# EAGLE design controllerver2 (EAGLE 6.6.0)
saraste valo controller ver 2 Muutoksia: vaihdettu 7hc165 oikeaan järjestykseen. listätty napppi encoderin liittimeen.
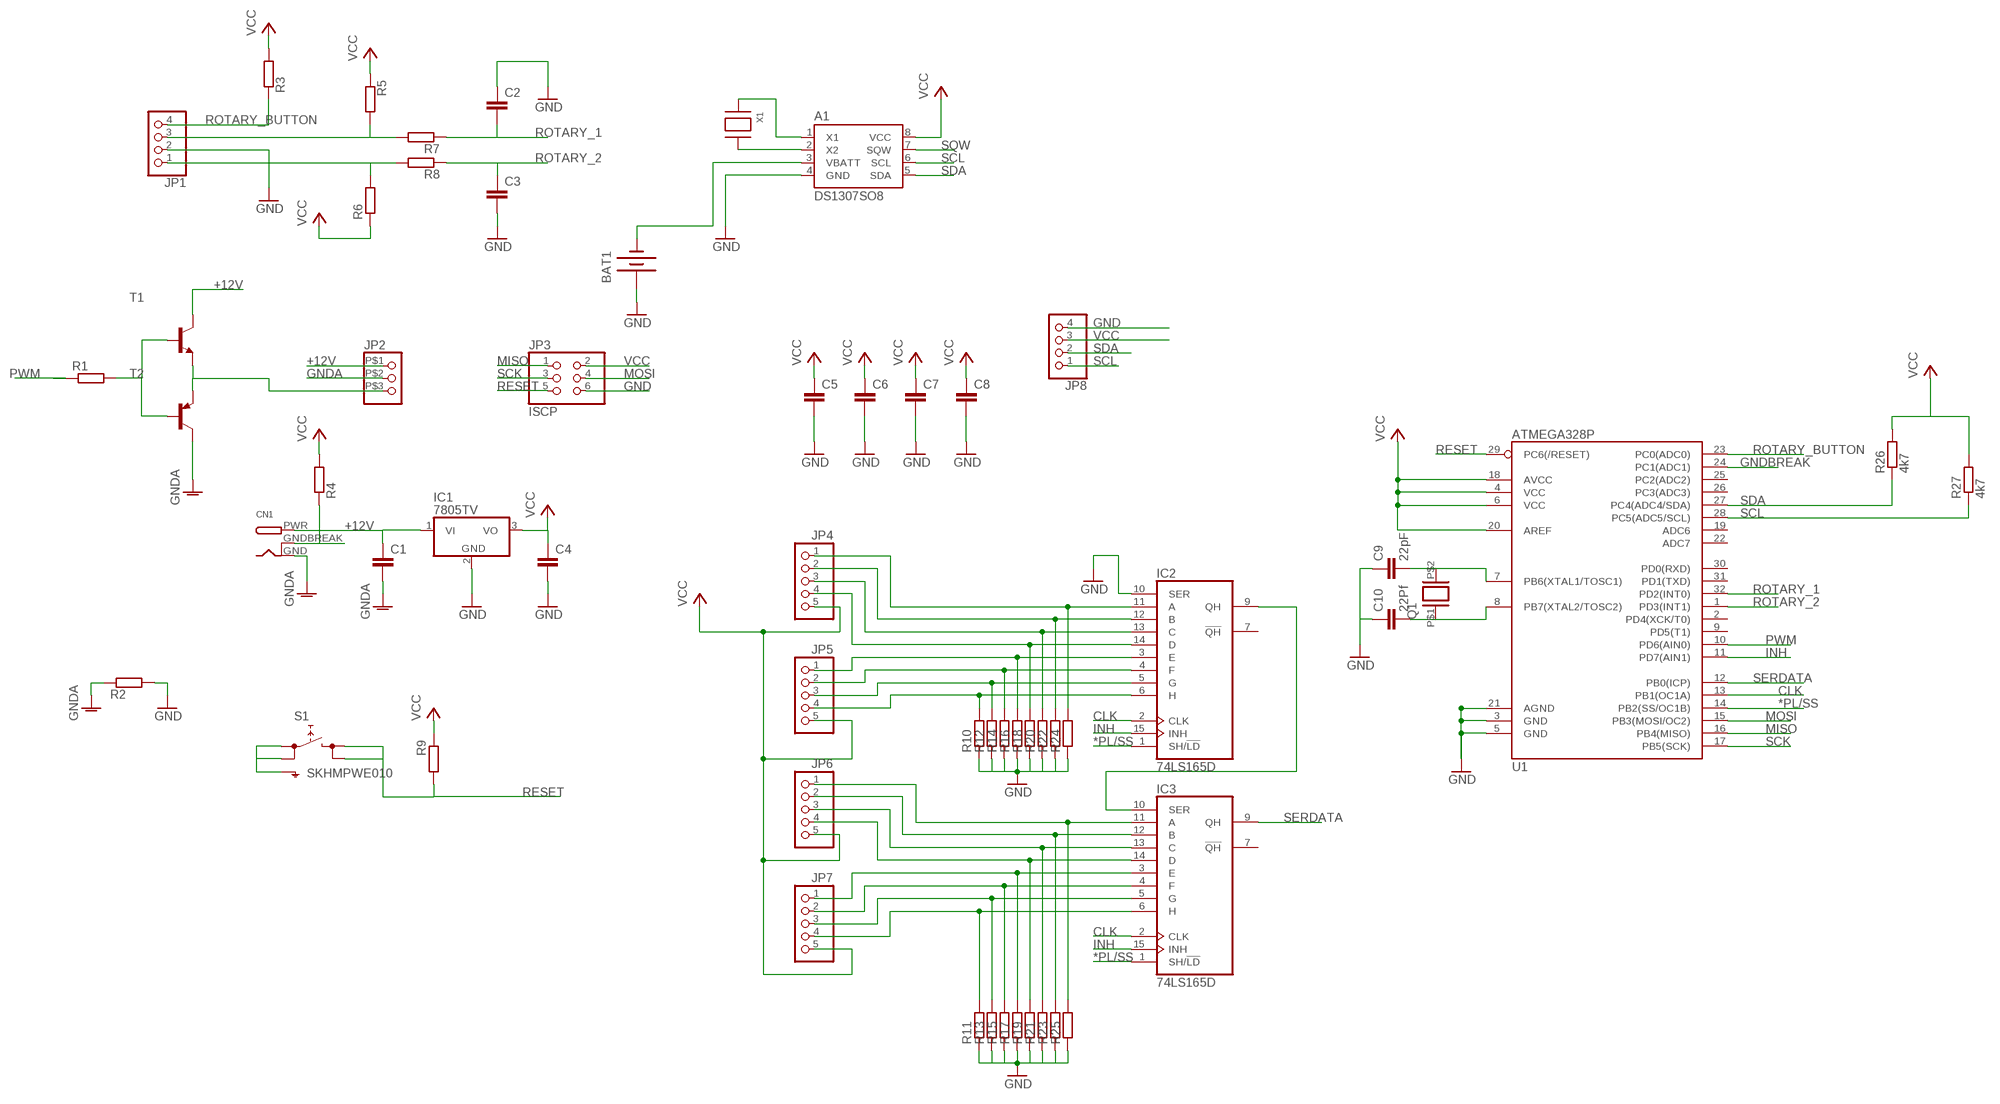
[diagram p0: schematic, sheet 1]

## Parts
A1  DS1307SO8  [SO08]
BAT1  BATTERY20SMD  [BATTCON_20MM]
C1  C-EUC0805  [C0805]
C2  C-EUC0805  [C0805]
C3  C-EUC0805  [C0805]
C4  C-EUC0805  [C0805]
C5  C-EUC0805  [C0805]
C6  C-EUC0805  [C0805]
C7  C-EUC0805  [C0805]
C8  C-EUC0805  [C0805]
C9  22pF  C-EUC0805  [C0805]
C10  22Pf  C-EUC0805  [C0805]
CN1  DCBARRELPTH  [DCJACK_2MM_PTH]
IC1  7805TV  [TO220V]
IC2  74LS165D  [SO16]
IC3  74LS165D  [SO16]
JP1  PINHD-1X4  [1X04]
JP2  PINHD-1X35.08  [1X03/5.08]
JP3  ISCP  PINHD-2X3  [2X03]
JP4  PINHD-1X5  [1X05]
JP5  PINHD-1X5  [1X05]
JP6  PINHD-1X5  [1X05]
JP7  PINHD-1X5  [1X05]
JP8  PINHD-1X4  [1X04]
Q1  XTAL  [CSM-3X]
R1  R-EU_R0805  [R0805]
R2  R-EU_R0805  [R0805]
R3  R-EU_R0805  [R0805]
R4  R-EU_R0805  [R0805]
R5  R-EU_R0805  [R0805]
R6  R-EU_R0805  [R0805]
R7  R-EU_R0805  [R0805]
R8  R-EU_R0805  [R0805]
R9  R-EU_R0805  [R0805]
R10  R-EU_R0805  [R0805]
R11  R-EU_R0805  [R0805]
R12  R-EU_R0805  [R0805]
R13  R-EU_R0805  [R0805]
R14  R-EU_R0805  [R0805]
R15  R-EU_R0805  [R0805]
R16  R-EU_R0805  [R0805]
R17  R-EU_R0805  [R0805]
R18  R-EU_R0805  [R0805]
R19  R-EU_R0805  [R0805]
R20  R-EU_R0805  [R0805]
R21  R-EU_R0805  [R0805]
R22  R-EU_R0805  [R0805]
R23  R-EU_R0805  [R0805]
R24  R-EU_R0805  [R0805]
R25  R-EU_R0805  [R0805]
R26  4k7  R-EU_R0805  [R0805]
R27  4k7  R-EU_R0805  [R0805]
S1  SKHMPWE010  [SKHMPXE010]
T1  BC847-NPN-SOT23-BEC  [SOT23-BEC]
T2  BC807-16-PNP-SOT23-BEC  [SOT23-BEC]
U1  ATMEGA328P  ATMEGA328_SMT  [TQFP32-08]
X1  XTAL-3.2X1.5  [XTAL3215]

## Nets
*PL/SS: IC2.1(SH/!LD) IC3.1(SH/!LD) U1.14(PB2(SS/OC1B))
+12V [high power]: C1.1 CN1.PWR IC1.1(VI) JP2.P$1 T1.C
CLK: IC2.2(CLK) IC3.2(CLK) U1.13(PB1(OC1A))
GND [gnd]: A1.4(GND) BAT1.1(+) C2.1 C3.2 C4.2 C5.2 C6.2 C7.2 C8.2 C9.1 C10.1 IC1.2(GND) IC2.10(SER) JP1.2 JP3.6 JP8.4 R2.2 R10.1 R11.1 R12.1 R13.1 R14.1 R15.1 R16.1 R17.1 R18.1 R19.1 R20.1 R21.1 R22.1 R23.1 R24.1 R25.1 S1.1(1.1) S1.2(1.2) S1.5(SH) U1.3(GND) U1.5(GND) U1.21(AGND)
GNDA [high power gnd]: C1.2 CN1.GND JP2.P$2 R2.1 T2.C
GNDBREAK: CN1.GNDBREAK R4.1 U1.24(PC1(ADC1))
INH: IC2.15(INH) IC3.15(INH) U1.11(PD7(AIN1))
MISO: JP3.1 U1.16(PB4(MISO))
MOSI: JP3.4 U1.15(PB3(MOSI/OC2))
N$1: IC2.11(A) JP4.1 R24.2
N$2: IC2.12(B) JP4.2 R22.2
N$3: IC2.13(C) JP4.3 R20.2
N$4: IC2.14(D) JP4.4 R18.2
N$5: IC2.3(E) JP5.1 R16.2
N$6: IC2.4(F) JP5.2 R14.2
N$7: IC2.5(G) JP5.3 R12.2
N$8: IC2.6(H) JP5.4 R10.2
N$9: IC3.11(A) JP6.1 R25.2
N$10: IC3.12(B) JP6.2 R23.2
N$11: IC3.13(C) JP6.3 R21.2
N$12: IC3.14(D) JP6.4 R19.2
N$13: IC3.3(E) JP7.1 R17.2
N$14: IC3.4(F) JP7.2 R15.2
N$15: IC3.5(G) JP7.3 R13.2
N$16: IC3.6(H) JP7.4 R11.2
N$17: JP1.3 R5.2 R7.2
N$18 [high power]: JP2.P$3 T1.E T2.E
N$19: JP1.1 R6.2 R8.2
N$20: IC2.9(QH) IC3.10(SER)
N$21: A1.3(VBATT) BAT1.2(-)
N$22: C9.2 Q1.P$2 U1.7(PB6(XTAL1/TOSC1))
N$23: C10.2 Q1.P$1 U1.8(PB7(XTAL2/TOSC2))
N$25: R1.2 T1.B T2.B
N$28: A1.2(X2) X1.P$2
N$29: A1.1(X1) X1.P$1
PWM: R1.1 U1.10(PD6(AIN0))
RESET: JP3.5 R9.2 S1.3(2.1) S1.4(2.2) U1.29(PC6(/RESET))
ROTARY_1: C2.2 R7.1 U1.32(PD2(INT0))
ROTARY_2: C3.1 R8.1 U1.1(PD3(INT1))
ROTARY_BUTTON: JP1.4 R3.1 U1.23(PC0(ADC0))
SCK: JP3.3 U1.17(PB5(SCK))
SCL: A1.6(SCL) JP8.1 R27.1 U1.28(PC5(ADC5/SCL))
SDA: A1.5(SDA) JP8.2 R26.1 U1.27(PC4(ADC4/SDA))
SERDATA: IC3.9(QH) U1.12(PB0(ICP))
SQW: A1.7(SQW)
VCC [vcc]: A1.8(VCC) C4.1 C5.1 C6.1 C7.1 C8.1 IC1.3(VO) JP3.2 JP4.5 JP5.5 JP6.5 JP7.5 JP8.3 R3.2 R4.2 R5.1 R6.1 R9.1 R26.2 R27.2 U1.4(VCC) U1.6(VCC) U1.18(AVCC) U1.20(AREF)
Unconnected: IC2.7(!QH) IC3.7(!QH) U1.2(PD4(XCK/T0)) U1.9(PD5(T1)) U1.19(ADC6) U1.22(ADC7) U1.25(PC2(ADC2)) U1.26(PC3(ADC3)) U1.30(PD0(RXD)) U1.31(PD1(TXD))

## Power pins joined to a net without a drawn wire
GND: IC2.8(GND) IC3.8(GND)
VCC: IC2.16(VCC) IC3.16(VCC)

## Library data of the parts
A1 = SparkFun-FreqCtrl:DS1307: I2C real-time clock with battery backup.
BAT1 = SparkFun-Electromechanical:BATTERY: Battery Holders Various common sizes : AA, AAA, 18650 (PRT-12895), 20mm coin cell and 12mm coin cell. 20MM_4LEGS, BATT-10373
C1-C10 = rcl:C-EU: CAPACITOR, European symbol
CN1 = adafruit:DCBARREL: 2.0mm DC Barrel Jack DCJACK_2MM_PTH - Through Hole Jack (4UConnector: 05537)
IC1 = linear:78*: Positive VOLTAGE REGULATOR Source: http://cache.national.com/ds/LM/LM78L05.pdf http://www.fairchildsemi.com/ds/LM/LM7805.pdf
IC2 IC3 = 74xx-us:74*165: 8-bit parallel load SHIFT REGISTER
JP1 JP8 = pinhead:PINHD-1X4: PIN HEADER
JP2 = 1omat:PINHD-1X3: PIN HEADER
JP3 = pinhead:PINHD-2X3: PIN HEADER
JP4-JP7 = pinhead:PINHD-1X5: PIN HEADER
Q1 = 1omat:XTAL: CRYSTAL
R1-R27 = resistor:R-EU_: RESISTOR, European symbol
S1 = switch:SKHMP*E010: 6.2 X 6.5mm TACT Switch (SMD) Source: http://www3.alps.co.jp/WebObjects/catalog.woa/PDF/E/Switch/Tact/SKHM/SKHM.PDF
T1 = transistor:*-NPN-: NPN Transistror BF959 corrected 2008.03.06
T2 = transistor:*-PNP-: PNP Transistror
U1 = SparkFun-DigitalIC:ATMEGA328_SMT: 32-Pin Atmega328 part Commonly used on Arduino compatible boards Available in QFP and QFN packages TQFP is IC-09069 QFN is non-stock; PROD_ID: IC-09069
X1 = adafruit:XTAL: Low cost SMT crystals, no capacitors included http://www.ladyada.net/library/eagle

## Net classes
0 default: width 0.254 mm, drill 0.33 mm
1 vcc: width 0.508 mm, drill 0.33 mm
2 gnd: width 0.508 mm, drill 0.33 mm
3 high power: width 1.016 mm, drill 0.508 mm
4 high power gnd: width 1.016 mm, drill 0.508 mm

## Board
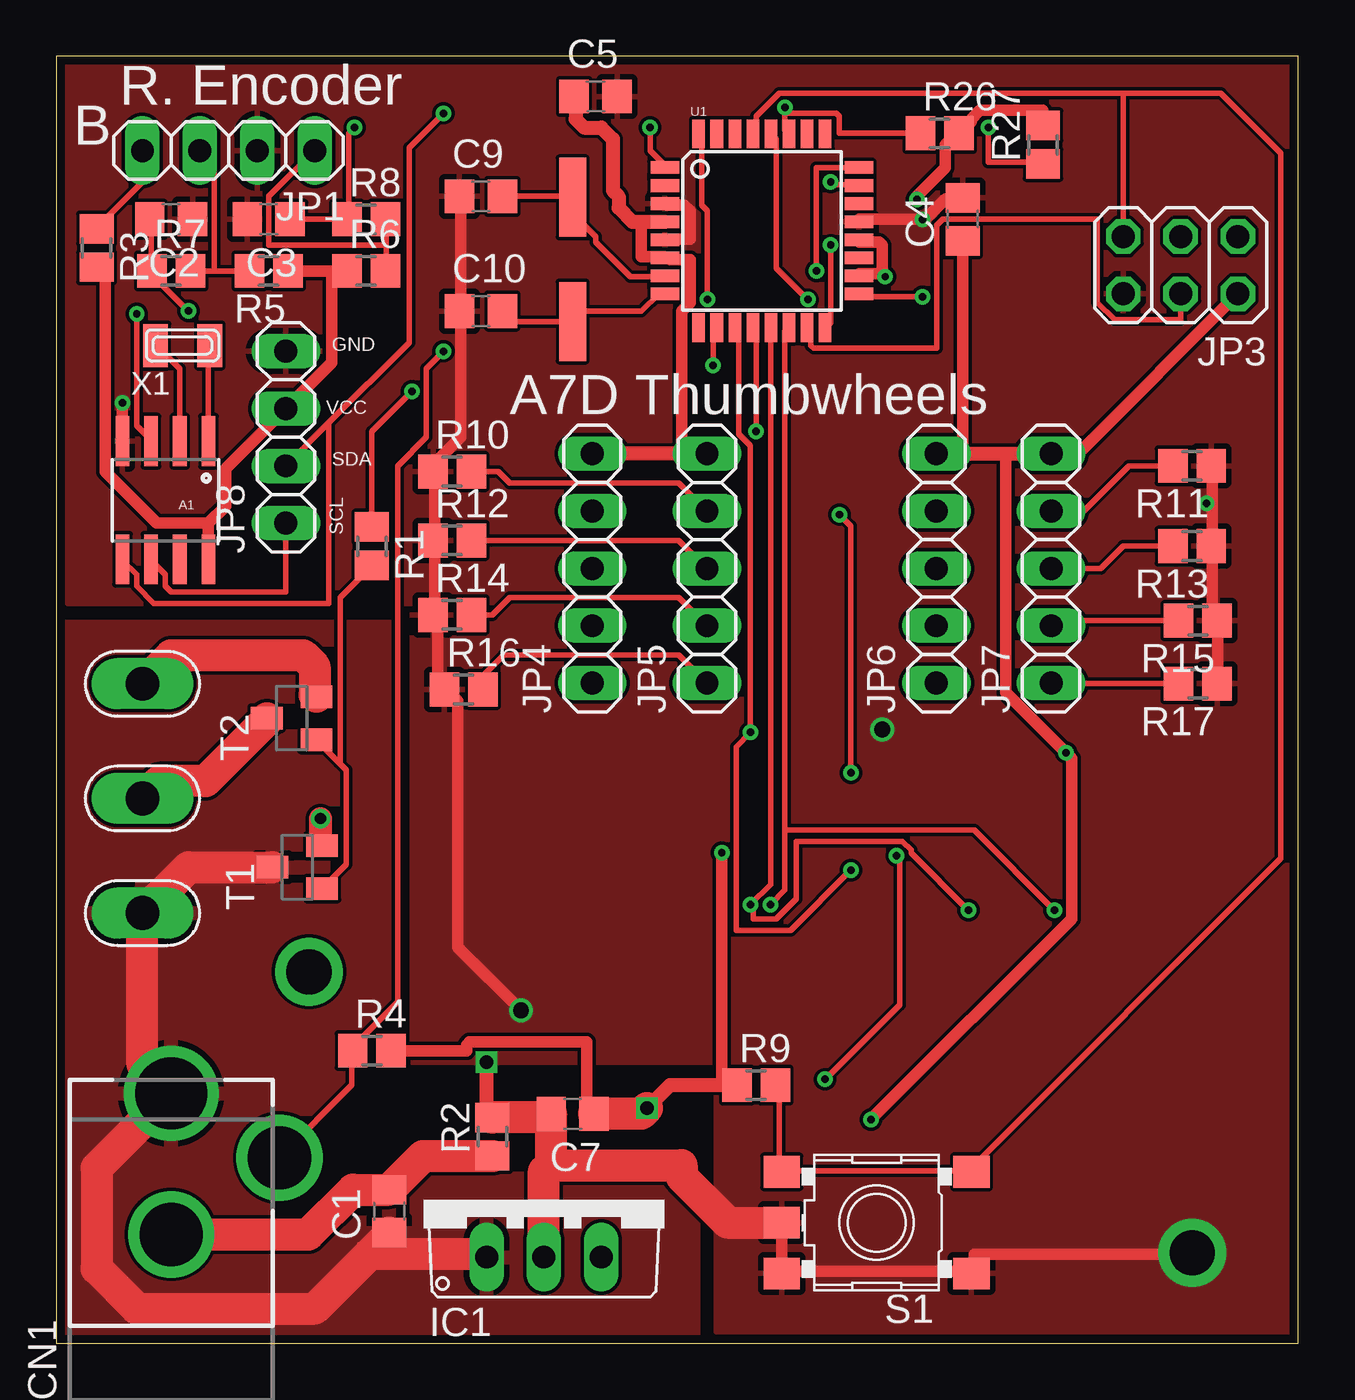
[diagram p1: board, top side]
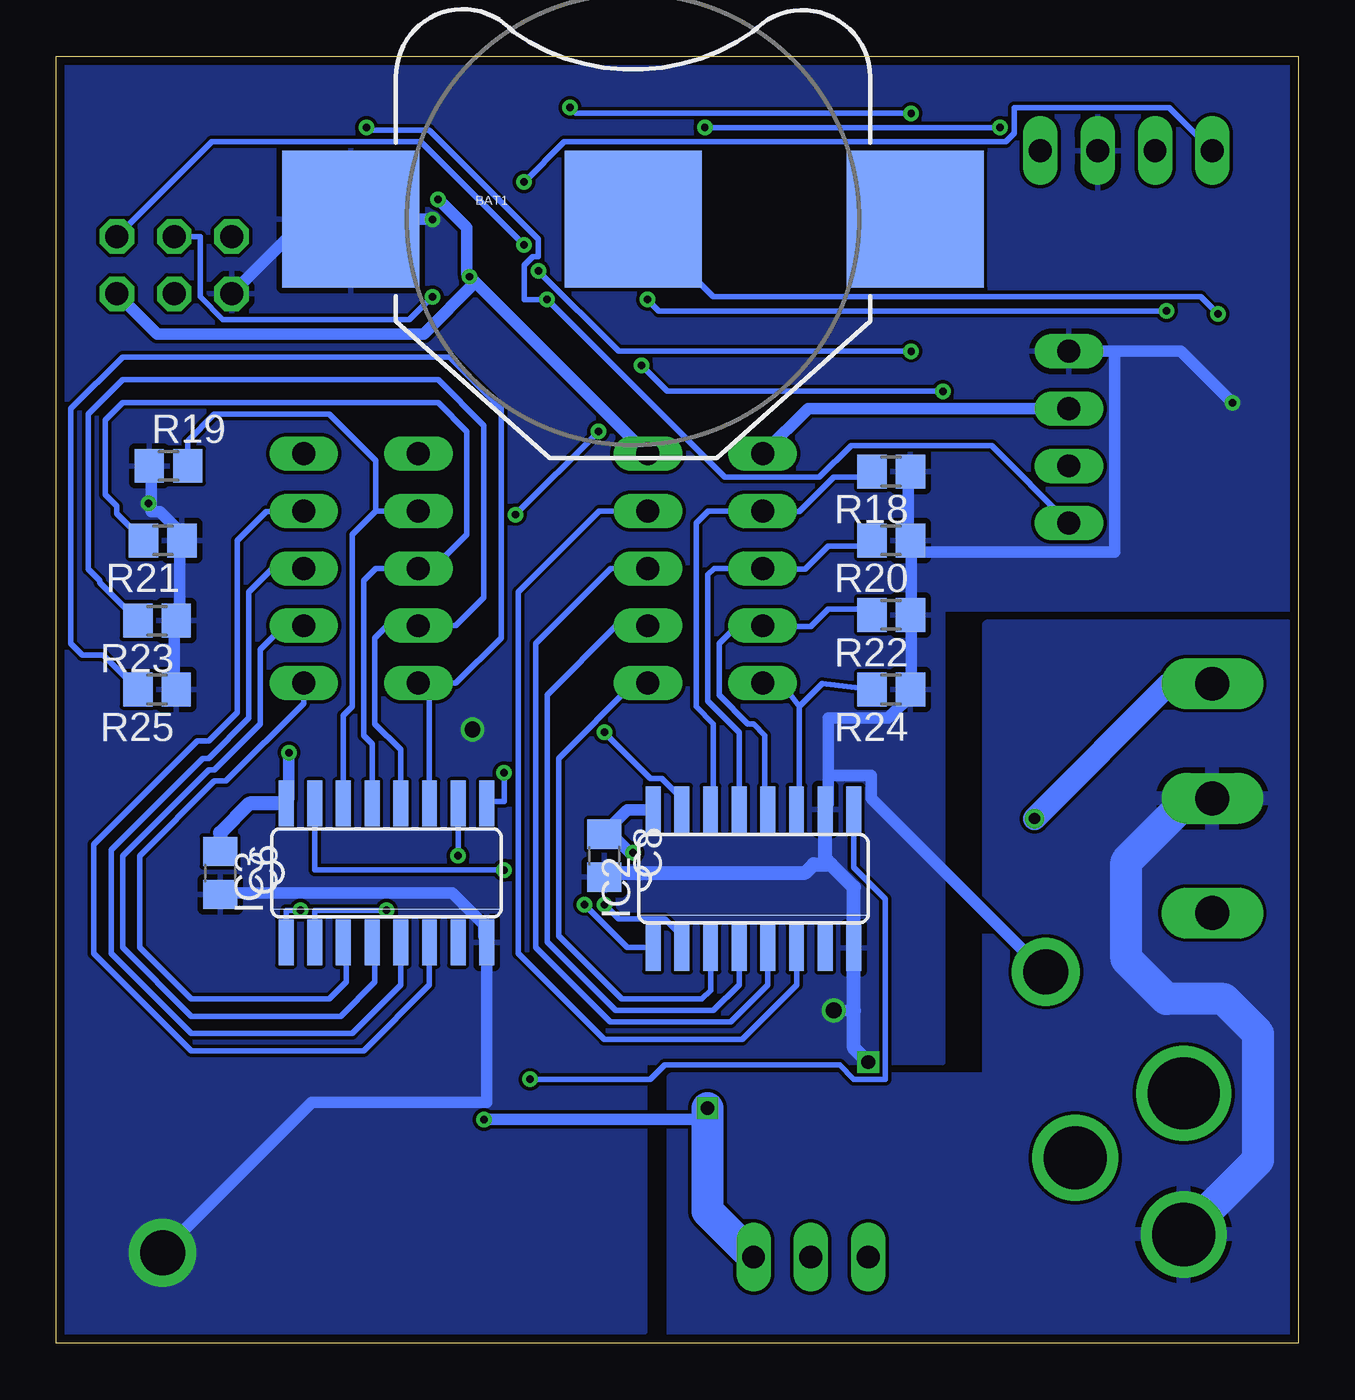
[diagram p2: board, bottom side, seen from below]

Size 55 x 57 mm. Coordinates in mm from the lower left corner, seen from the top.
Outline: 0,0 55,0 55,57 0,57 0,0
Copper layers (1*16): Top 0.0356mm / dielectric 1.5011mm / Bottom 0.0356mm
Design rules "LaenPCBOrder": minimum track width 6mil, minimum drill 13mil, track to track 6mil, track to pad 6mil, pad to pad 6mil, via to via 6mil, smd to smd 6mil, copper to edge 15mil, drill to drill 6mil, minimum pad ring 7mil, minimum via ring 7mil, stop-mask expansion 3mil, vias tented up to drill 0mil, thermal gap 10mil

### Footprints (pad centres in the part's own frame; a part is rotated, then mirrored left to right if it is on the bottom)
SO08 = smd 0.61 x 2.21: 1 -1.905,-2.616; 2 -0.635,-2.616; 3 0.635,-2.616; 4 1.905,-2.616; 5 1.905,2.616; 6 0.635,2.616; 7 -0.635,2.616; 8 -1.905,2.616
BATTCON_20MM = smd 6.07 x 6.07: 1 -12.5,0; 2 0,0; 3 12.5,0
C0805 = smd 1.3 x 1.5: 1 -0.95,0; 2 0.95,0
DCJACK_2MM_PTH = drill 2.8: GND 0,7.35; GNDBREAK 4.8,10.75 | drill 3.2: PWR 0,13.6
TO220V = drill 1.016 long: 1 -2.54,-2.54; 2 0,-2.54; 3 2.54,-2.54
SO16 = smd 0.66 x 2.032: 1 -4.445,-3.073; 2 -3.175,-3.073; 3 -1.905,-3.073; 4 -0.635,-3.073; 5 0.635,-3.073; 6 1.905,-3.073; 7 3.175,-3.073; 8 4.445,-3.073; 9 4.445,3.073; 10 3.175,3.073; 11 1.905,3.073; 12 0.635,3.073; 13 -0.635,3.073; 14 -1.905,3.073; 15 -3.175,3.073; 16 -4.445,3.073
1X04 = drill 1.016 long: 1 -3.81,0; 2 -1.27,0; 3 1.27,0; 4 3.81,0
1X03/5.08 = drill 1.5 long: P$1 -5.08,0; P$2 0,0; P$3 5.08,0
2X03 = drill 1.016 octagon: 1 -2.54,-1.27; 2 -2.54,1.27; 3 0,-1.27; 4 0,1.27; 5 2.54,-1.27; 6 2.54,1.27
1X05 = drill 1.016 long: 1 -5.08,0; 2 -2.54,0; 3 0,0; 4 2.54,0; 5 5.08,0
CSM-3X = smd 3.5 x 1.2: P$1 -2.75,0; P$2 2.75,0
R0805 = smd 1.3 x 1.5: 1 -0.85,0; 2 0.85,0
SKHMPXE010 = smd 1.6 x 1.4: 1 -4.2,2.25; 2 4.2,2.25; 3 -4.2,-2.25; 4 4.2,-2.25; 5 4.2,0
SOT23-BEC = smd 1 x 1.4: B -0.95,-1.1; C 0,1.1; E 0.95,-1.1
TQFP32-08 = smd 1.27 x 0.559: 1 -4.293,2.8; 2 -4.293,2; 3 -4.293,1.2; 4 -4.293,0.4; 5 -4.293,-0.4; 6 -4.293,-1.2; 7 -4.293,-2; 8 -4.293,-2.8; 17 4.293,-2.8; 18 4.293,-2; 19 4.293,-1.2; 20 4.293,-0.4; 21 4.293,0.4; 22 4.293,1.2; 23 4.293,2; 24 4.293,2.8 | smd 0.559 x 1.27: 9 -2.8,-4.293; 10 -2,-4.293; 11 -1.2,-4.293; 12 -0.4,-4.293; 13 0.4,-4.293; 14 1.2,-4.293; 15 2,-4.293; 16 2.8,-4.293; 25 2.8,4.293; 26 2,4.293; 27 1.2,4.293; 28 0.4,4.293; 29 -0.4,4.293; 30 -1.2,4.293; 31 -2,4.293; 32 -2.8,4.293
XTAL3215 = smd 1.1 x 1.9: P$1 1.2,0; P$2 -1.2,0

### Placement (x,y rotation side)
A1  4.83,37.34 180 top
BAT1  29.46,49.78 0 bottom
C1  14.73,5.84 90 top
C2  5.08,49.78 180 top
C3  9.4,49.78 180 top
C4  40.13,49.78 90 top
C5  23.88,55.23 0 top
C6  47.75,20.83 270 bottom
C7  22.86,10.16 180 top
C8  30.73,21.59 270 bottom
C9  18.8,50.8 0 top
C10  18.8,45.72 0 top
CN1  5.08,-2.54 0 top
IC1  21.59,6.35 0 top
IC2  24.13,20.57 0 bottom
IC3  40.39,20.83 0 bottom
JP1  7.62,52.83 180 top
JP2  3.81,24.13 90 top
JP3  49.78,47.75 180 top
JP4  23.73,34.32 90 top
JP5  28.81,34.32 90 top
JP6  38.97,34.32 90 top
JP7  44.05,34.32 90 top
JP8  10.16,40.13 90 top
Q1  22.86,48.01 90 top
R1  13.97,35.31 270 top
R2  19.3,9.14 90 top
R3  1.78,48.51 270 top
R4  13.97,12.95 0 top
R5  9.4,47.5 180 top
R6  13.72,47.5 0 top
R7  5.08,47.5 0 top
R8  13.72,49.78 0 top
R9  30.99,11.43 0 top
R10  17.53,38.61 0 top
R11  50.29,38.86 180 top
R12  17.53,35.56 0 top
R13  50.29,35.31 180 top
R14  17.53,32.26 0 top
R15  50.55,32 180 top
R16  18.03,28.96 0 top
R17  50.55,29.21 180 top
R18  18.03,38.61 180 bottom
R19  50.04,38.86 0 bottom
R20  18.03,35.56 180 bottom
R21  50.29,35.56 180 bottom
R22  18.03,32.26 180 bottom
R23  50.55,32 180 bottom
R24  18.03,28.96 180 bottom
R25  50.55,28.96 180 bottom
R26  39.12,53.59 0 top
R27  43.69,53.09 90 top
S1  36.32,5.33 180 top
T1  10.67,21.08 90 top
T2  10.41,27.69 90 top
U1  31.24,49.28 0 top
X1  5.59,44.2 0 top

### Tracks (layer width: path | path; a pad name or v marks a point on that pad's centre or on a via)
*PL/SS  (via drill 0.33)
  Top 0.254: 32.26,22.73 32.26,20.07 v31.62,19.43 | 32.26,22.73 32.26,44.83 32.38,44.96 U1.14 | v44.2,19.18 40.64,22.73 32.26,22.73
  Bottom 0.254: v31.62,19.43 29.72,17.53 28.57,17.53 IC2.1 | IC3.1 44.83,19.18 v44.2,19.18
+12V
  Top 1.422: T1.C 5.84,21.08 JP2.P$1 3.81,12.33 CN1.PWR 1.78,7.76 1.78,3.3 3.56,1.52 11.43,1.52 13.84,3.94 | 13.84,3.94 14.73,4.83 C1.1 | IC1.1 18.92,3.94 13.84,3.94
  pour Top: 0.51,31.75 14.73,31.75 14.73,11.43 28.19,11.43 28.19,0.25 0.51,0.25
CLK  (via drill 0.33)
  Top 0.254: U1.13 31.62,44.96 31.62,20.32 v30.73,19.43 30.86,19.43 30.86,18.8 31.88,18.8 32.77,19.68 32.77,22.23 37.47,22.23 37.85,21.84 37.85,21.72 v40.39,19.18
  Bottom 0.254: v30.73,19.43 30.1,18.8 28.07,18.8 27.3,18.03 IC2.2 | IC3.2 43.56,19.18 v40.39,19.18
GND  (via drill 0.33, 0.6, 0.7, 2)
  Top 0.508: R17.1 51.44,29.21 51.44,32 R15.1 51.18,32.13 51.18,35.31 R13.1 51.18,35.43 51.18,37.21 | 51.18,37.21 51.18,38.86 R11.1 | v50.93,37.21 51.18,37.21 | S1.5 32.13,4.7 32.13,3.17 S1.2 32.38,3.17 40.26,3.17 S1.1 40.64,3.3 40.64,3.94 50.29,3.94 v50.3,4 | U1.21 35.56,49.78 v38.35,49.78 38.48,49.78 39.37,50.67 40.13,50.67 C4.2 | C9.1 17.91,50.8 17.91,45.72 C10.1 17.91,45.59 17.91,40.13 16.89,39.12 16.89,38.73 R10.1 16.76,38.61 16.76,35.69 R12.1 16.76,35.56 16.76,32.26 R14.1 16.89,32.13 16.89,29.21 17.14,28.96 R16.1 17.4,28.83 17.78,28.45 17.78,17.53 v20.57,14.73 | U1.5 27.05,48.9 28.07,48.9 28.07,50.16 27.81,50.42 27.05,50.42 U1.3 | v2.92,41.66 A1.4
  Top 0.61: R2.2 19.05,10.25 v19.05,12.45
  Top 1.422: IC1.2 21.59,7.62 arc90 21.91,7.94 | 21.91,7.94 C7.2 arc-90 21.74,9.99 R2.2 | 21.91,7.94 arc90 21.98,7.87 27.69,7.87 27.69,7.37 29.72,5.33 S1.5
  Bottom 0.508: R25.1 49.78,28.96 49.78,32 R23.1 49.53,32.13 49.53,35.56 R21.1 49.28,35.69 50.42,36.83 50.8,36.83 50.8,37.21 | 50.8,37.21 50.8,38.86 R19.1 | v50.93,37.21 50.8,37.21 | 17.27,28.96 R16.1 | 17.27,32.26 R22.1 | C6.2 47.75,19.94 37.47,19.94 36.07,18.54 36.07,18.03 IC3.8 35.94,10.67 43.69,10.67 50.29,4.06 v50.3,4 | v38.35,49.78 BAT1.1 42.16,49.66 44.07,49.66 JP3.6 | v2.92,41.66 5.21,43.94 8.13,43.94 | JP8.4 8.13,43.94 | R20.1 17.27,35.56 17.27,38.61 R18.1 | 19.68,14.73 v20.57,14.73 | 20.83,25.15 20.83,27.69 18.16,27.69 17.02,28.83 R16.1 | 20.83,25.15 20.83,23.88 IC2.10 | R22.1 17.14,32.13 17.14,29.21 R16.1 | 20.83,25.15 18.92,25.15 18.92,24.13 11.3,16.51 v11.18,16.45 | R20.1 17.14,35.43 17.14,32.51 R22.1 | 8.13,43.94 8.13,35.05 17.02,35.05 R20.1
  Bottom 0.61: v19.05,12.45 19.68,13.08 19.68,14.73 IC2.8 19.68,20.19 20.7,21.21 | 20.7,21.21 20.95,21.46 IC2.10 | C8.2 30.55,20.83 21.84,20.83 21.46,21.21 20.7,21.21
  other vias: 36.58,27.18
  pour Top: 0.51,56.64 0.51,32.77 15.75,32.77 15.75,12.45 29.21,12.45 29.21,0.51 54.86,0.51 54.86,56.64
  pour Bottom: 0,56.9 0,32.51 15.75,32.51 15.75,12.45 28.96,12.45 28.96,0.51 54.86,0.51 54.86,56.9
GNDA
  Top 1.422: R2.1 16.23,8.29 C1.2 13.14,6.79 11.16,4.81 CN1.GND | T2.C 9.31,27.6 6.6,24.89 4.57,24.89 JP2.P$2
  Bottom 1.422: JP2.P$2 4.83,24.13 7.62,21.34 7.62,17.02 5.84,15.24 3.3,15.24 1.78,13.72 1.78,8.11 CN1.GND
  pour Bottom: 0.51,31.75 13.72,31.75 13.72,16 13.72,11.68 27.69,11.68 27.69,0.51 0.51,0.51
GNDBREAK  (via drill 0.33)
  Top 0.254: CN1.GNDBREAK 9.91,8.26 13.08,11.43 13.08,12.95 R4.1 13.21,12.95 13.21,13.21 15.11,15.11 15.11,38.86 16.38,40.13 16.38,43.18 v17.14,43.94 | v33.66,47.5 33.66,52.07 35.43,52.07 U1.24
  Bottom 0.254: v33.66,47.5 30.1,43.94 v17.14,43.94
INH  (via drill 0.33)
  Top 0.254: U1.11 30.1,44.96 30.23,44.83 30.23,40.26 30.73,39.75 v30.73,27.05 30.1,26.42 30.1,18.29 32.51,18.29 v35.18,20.95
  Bottom 0.254: v30.73,27.05 28.7,25.02 28.19,25.02 27.3,24.13 IC2.15 | IC3.15 43.56,20.95 v35.18,20.95
MISO  (via drill 0.33)
  Top 0.254: v34.29,48.64 34.29,45.21 34.16,45.09 U1.16
  Bottom 0.254: v34.29,48.64 38.86,53.21 48.13,53.21 JP3.1
MOSI
  Top 0.254: JP3.4 49.78,45.34 46.86,45.34 46.1,46.1 46.1,49.78 39.24,49.78 38.99,49.53 38.99,44.07 33.53,44.07 33.4,44.2 33.4,44.83 33.27,44.96 U1.15
N$1
  Bottom 0.254: IC2.11 22.1,23.77 22.1,28.19 | 22.1,28.19 22.89,29.24 JP4.1 | 22.1,28.19 21.08,29.21 R24.2
N$2
  Bottom 0.254: IC2.12 23.62,23.77 23.62,26.92 24.13,27.43 24.38,27.43 25.65,28.7 25.65,30.99 24.89,31.75 23.76,31.75 JP4.2 23.7,31.75 21.59,31.75 20.83,32.51 19.14,32.51 R22.2
N$3
  Bottom 0.254: IC2.13 24.77,27.05 26.16,28.45 26.16,34.04 25.88,34.32 JP4.3 23.7,34.29 21.84,34.29 20.83,35.31 19.14,35.31 R20.2
N$4
  Bottom 0.254: IC2.14 25.91,23.77 25.91,27.43 26.67,28.19 26.67,36.32 26.13,36.86 JP4.4 23.7,36.83 22.1,36.83 20.57,38.35 19.14,38.35 R18.2
N$5
  Top 0.254: JP5.1 27.57,30.48 19.81,30.48 18.54,29.21 R16.2
  Bottom 0.254: IC2.3 26.04,15.62 26.42,15.24 29.97,15.24 32.77,18.03 32.77,25.91 29.44,29.24 JP5.1
N$6
  Top 0.254: JP5.2 27.57,33.02 20.07,33.02 19.3,32.26 R14.2
  Bottom 0.254: IC2.4 24.77,15.88 25.91,14.73 30.23,14.73 33.27,17.78 33.27,28.7 30.2,31.78 JP5.2
N$7
  Top 0.254: R12.2 27.57,35.56 JP5.3
  Bottom 0.254: IC2.5 23.5,15.88 25.15,14.22 30.48,14.22 33.78,17.53 33.78,30.99 30.45,34.32 JP5.3
N$8
  Top 0.254: JP5.4 27.57,38.1 20.07,38.1 19.56,38.61 R10.2
  Bottom 0.254: IC2.6 22.23,15.88 24.64,13.46 30.73,13.46 34.54,17.27 34.54,33.27 30.96,36.86 JP5.4
N$9
  Bottom 0.254: IC3.11 38.48,28.75 JP6.1 37.31,29.24 35.31,31.24 35.31,41.4 37.59,43.69 52.07,43.69 54.36,41.4 54.36,30.99 53.85,30.48 52.92,30.48 R25.2
N$10
  Bottom 0.254: R23.2 53.09,33.69 53.09,33.78 53.59,34.29 53.59,41.15 52.07,42.67 38.1,42.67 36.07,40.64 36.07,33.02 37.31,31.78 JP6.2 40.36,31.78 40.89,31.24 40.89,27.43 39.75,26.29 IC3.12
N$11
  Bottom 0.254: R21.2 52.32,36.74 52.32,37.08 52.83,37.59 52.83,40.89 52.07,41.66 38.1,41.66 36.83,40.39 36.83,35.81 38.33,34.32 JP6.3 40.87,34.32 41.4,33.78 41.4,26.92 41.02,26.54 IC3.13
N$12
  Bottom 0.254: IC3.14 42.29,27.81 41.91,28.19 41.91,35.81 40.87,36.86 | 40.87,36.86 JP6.4 | R19.2 49.19,39.97 48.01,41.15 42.93,41.15 40.87,39.09 40.87,36.86
N$13
  Top 0.254: R17.2 44.08,29.21 JP7.1
  Bottom 0.254: IC3.3 42.16,17.63 42.16,16 42.93,15.24 49.02,15.24 51.31,17.53 51.31,21.59 48.01,24.89 47.5,24.89 44.05,28.34 JP7.1
N$14
  Top 0.254: R15.2 44.28,32 JP7.2
  Bottom 0.254: IC3.4 40.89,17.63 40.89,16 42.42,14.48 49.02,14.48 52.07,17.53 52.07,21.59 48.26,25.4 48.01,25.4 45.97,27.43 45.97,30.73 44.7,32 44.28,32 JP7.2
N$15
  Top 0.254: JP7.3 46.26,34.32 47.24,35.31 R13.2
  Bottom 0.254: IC3.5 39.75,15.88 41.91,13.72 49.02,13.72 52.58,17.27 52.58,21.84 48.51,25.91 48.26,25.91 46.48,27.69 46.48,33.27 45.44,34.32 JP7.3
N$16
  Top 0.254: JP7.4 45.49,36.86 47.5,38.86 R11.2
  Bottom 0.254: IC3.6 38.48,15.88 41.4,12.95 49.02,12.95 53.34,17.27 53.34,22.1 48.77,26.67 48.26,26.67 46.99,27.94 46.99,35.56 45.72,36.83 44.08,36.83 JP7.4
N$17
  Top 0.254: R5.2 6.99,47.5 | 6.99,47.5 R7.2 | 6.99,47.5 6.99,52.2 JP1.3
N$18  (via drill 0.51)
  Top 1.016: v11.68,23.24 11.68,22.1 T1.E
  Top 1.422: JP2.P$3 5.08,30.48 10.92,30.48 11.43,29.97 11.43,28.72 T2.E
  Bottom 1.016: v11.68,23.24 5.71,29.21 JP2.P$3
N$19
  Top 0.254: 14.61,48.64 14.61,49.78 R8.2 | 14.61,48.64 14.61,47.5 R6.2 | 14.61,48.64 9.4,48.64 9.4,50.8 JP1.1
N$20  (via drill 0.33)
  Top 0.254: v34.04,11.68 37.34,14.99 37.34,21.46 v37.21,21.59
  Bottom 0.254: IC2.9 19.68,21.08 18.29,19.68 18.29,11.68 19.68,11.68 20.32,12.32 28.07,12.32 28.7,11.68 v34.04,11.68 | IC3.10 v37.21,21.59
N$21  (via drill 0.33)
  Top 0.254: v3.56,45.59 3.56,40.64 4.19,40.01 A1.3
  Bottom 0.254: v3.56,45.59 4.32,46.35 25.91,46.35 29.34,49.78 BAT1.2
N$22
  Top 0.254: C9.2 23.11,50.8 Q1.P$2 22.86,50.04 23.88,49.02 23.88,48.77 25.4,47.24 26.92,47.24 U1.7
N$23
  Top 0.254: C10.2 20.21,45.26 Q1.P$1 23.32,45.72 25.91,45.72 26.66,46.48 U1.8
N$25
  Top 0.254: 12.51,25.72 11.56,26.67 T2.B | 12.51,25.72 12.83,25.4 12.83,21.21 11.81,20.19 T1.B | R1.2 13.97,34.42 12.57,33.02 12.57,25.78 12.51,25.72
N$28
  Top 0.254: A1.2 5.46,43.18 4.45,44.2 X1.P$2
N$29
  Top 0.254: A1.1 6.73,44.2 X1.P$1
PWM  (via drill 0.33)
  Top 0.254: v29.08,43.31 29.08,44.83 29.21,44.96 U1.10 | v15.75,42.16 13.97,40.39 R1.1
  Bottom 0.254: v29.08,43.31 27.94,42.16 v15.75,42.16
RESET
  Top 0.254: R9.2 31.88,11.43 32,11.3 32,7.62 S1.4 32.13,7.62 40.51,7.62 S1.3 40.51,7.75 54.23,21.46 54.23,52.7 51.56,55.37 47.24,55.37 | 47.24,55.37 32,55.37 30.99,54.36 30.99,53.72 30.86,53.59 U1.29 | JP3.5 47.24,55.37
ROTARY_1  (via drill 0.33)
  Top 0.254: v28.83,46.23 28.83,50.16 28.57,50.42 28.57,53.34 28.45,53.47 U1.32 | v5.84,45.72 4.32,47.24 4.32,47.5 R7.1 4.19,47.5 4.19,49.78 C2.2
  Bottom 0.254: v28.83,46.23 28.32,45.72 v5.84,45.72
ROTARY_2  (via drill 0.33)
  Top 0.254: v26.29,53.85 26.29,52.83 26.92,52.2 U1.1 | v13.21,53.85 12.95,53.59 12.95,49.78 R8.1 C3.1
  Bottom 0.254: v13.21,53.85 v26.29,53.85
ROTARY_BUTTON  (via drill 0.33)
  Top 0.254: v34.29,51.44 34.29,51.31 35.43,51.31 U1.23 | JP1.4 3.81,51.44 1.78,49.4 R3.1
  Bottom 0.254: v34.29,51.44 32.51,53.21 12.95,53.21 12.57,53.59 12.57,54.74 5.71,54.74 JP1.4
SCK  (via drill 0.33)
  Top 0.254: v38.35,46.35 35.56,46.35 U1.17
  Bottom 0.254: v38.35,46.35 39.37,45.34 47.62,45.34 48.64,46.35 48.64,49.02 JP3.3
SCL  (via drill 0.33)
  Top 0.254: v33.27,46.23 31.88,47.62 31.88,53.34 31.75,53.47 U1.28 | JP8.1 10.16,33.27 5.08,33.27 4.83,33.53 4.83,34.04 4.19,34.67 A1.6 | v41.27,53.85 41.27,52.32 43.69,52.32 R27.1
  Bottom 0.254: JP8.1 13.59,39.75 19.81,39.75 21.21,38.35 25.4,38.35 v33.27,46.23 34.29,46.23 34.29,47.75 33.91,48.13 33.66,48.13 33.66,48.9 38.48,53.72 41.15,53.72 v41.27,53.85
SDA  (via drill 0.33)
  Top 0.254: 32.26,54.48 32.26,53.72 32.38,53.59 U1.27 | v17.14,54.48 15.62,52.96 15.62,44.32 12,40.7 | JP8.2 12,40.7 | A1.5 2.92,34.67 3.56,34.04 3.56,33.53 4.32,32.77 12.06,32.77 12.06,40.64 12,40.7 | R26.1 34.67,53.59 34.67,54.36 34.54,54.48 32.26,54.48 | 32.26,54.48 v32.26,54.74
  Bottom 0.254: v32.26,54.74 32,54.48 v17.14,54.48
SERDATA  (via drill 0.33)
  Top 0.254: v30.99,40.39 30.99,44.83 30.86,44.96 U1.12 | v34.67,36.7 35.18,36.2 v35.18,25.27
  Bottom 0.254: v34.67,36.7 v30.99,40.39 | v35.18,25.27 35.18,24 35.94,24 IC3.9
VCC  (via drill 0.33, 0.6)
  Top 0.508: R4.2 18.16,12.95 18.16,13.21 18.29,13.34 23.5,13.34 23.5,10.79 C7.1 | 42.04,39.4 42.04,28.83 v44.7,26.16 44.96,25.91 44.96,18.8 v36.07,9.91 | 22.73,55.5 C5.1 22.99,54.99 | 36.58,47.37 35.56,47.37 U1.18 | 36.58,47.37 36.58,48.64 36.45,48.77 35.56,48.77 U1.20 | 25.91,49.68 25.91,48.13 26.92,48.13 U1.6 27.18,48.01 28.07,48.01 28.07,46.1 27.69,45.72 27.69,39.62 JP5.5 | v36.7,47.24 36.58,47.37 | R6.1 12.19,47.5 | 12.19,47.5 R5.1 | 12.19,47.5 12.19,43.43 JP8.3 7.49,38.73 7.49,37.08 6.73,36.32 | 6.73,36.32 4.45,36.32 2.16,38.61 2.16,47.24 1.78,47.62 R3.2 | A1.8 6.73,36.32 | 29.46,11.43 v29.46,21.72 | C4.1 40.13,39.62 JP6.5 | JP3.2 45.34,39.5 44.32,39.5 JP7.5 | R27.2 43.69,54.61 40.89,54.61 40.51,54.23 40.51,54.1 40.01,53.59 R26.2 39.75,53.47 39.37,53.09 39.37,52.07 38.1,50.8 v38.1,50.67
  Top 0.61: v26.16,10.41 27.18,11.43 29.46,11.43 R9.1 | JP5.5 JP4.5 | JP6.5 42.04,39.4 JP7.5 | 22.99,54.99 22.99,54.23 23.37,53.85 24.13,53.85 24.64,53.34 24.64,51.05 24.89,50.8 24.89,50.29 25.51,49.68 25.91,49.68 U1.4
  Top 1.422: v26.16,10.41 25.91,10.16 C7.1
  Bottom 0.508: v44.7,26.16 44.7,24.13 IC3.16 | 36.45,46.99 28.96,39.5 28.83,39.5 JP5.5 | 36.45,46.99 v36.7,47.24 36.83,47.37 36.83,49.4 v38.1,50.67 | JP8.3 21.72,41.4 23.62,39.5 JP4.5 | IC2.16 28.57,23.62 29.72,23.62 30.73,22.61 C8.1 30.48,22.61 29.59,21.72 v29.46,21.72 | v36.07,9.91 26.16,9.91 | 36.45,46.99 38.73,44.7 50.55,44.7 JP3.2
  Bottom 0.61: IC3.16 46.46,23.9 47.75,22.61 C6.1
  Bottom 1.422: IC1.3 26.16,5.84 26.16,9.91 v26.16,10.41

### Text on the board
tNames: R. Encoder | B | GND | VCC | A7D Thumbwheels | SDA | SCL